# Altium schematic sheet TivaETH.SchDoc
size A4
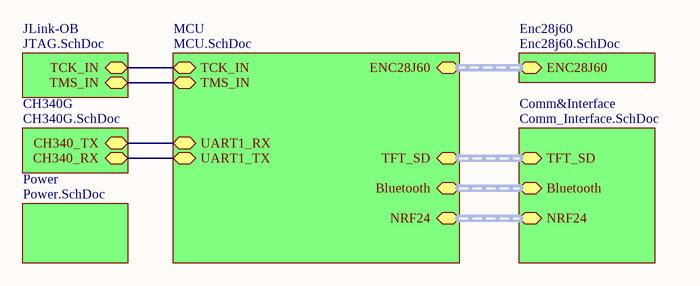
[diagram p0: TivaETH.SchDoc]

## Sub-sheets
CH340G = CH340G.SchDoc: CH340_RX, CH340_TX
Comm&Interface = Comm_Interface.SchDoc: TFT_SD (harness TFT_SD), Bluetooth (harness Bluetooth), NRF24 (harness NRF24)
Enc28j60 = Enc28j60.SchDoc: ENC28J60 (harness Enc28j60)
JLink-OB = JTAG.SchDoc: TCK_IN, TMS_IN
MCU = MCU.SchDoc: TCK_IN, TMS_IN, UART1_RX, UART1_TX, ENC28J60 (harness Enc28j60), Bluetooth (harness Bluetooth), NRF24 (harness NRF24), TFT_SD (harness TFT_SD)
Power = Power.SchDoc: no entries

## Nets
(unnamed): sheet JLink-OB/TCK_IN, sheet MCU/TCK_IN
(unnamed): sheet JLink-OB/TMS_IN, sheet MCU/TMS_IN
(unnamed): sheet MCU/UART1_RX, sheet CH340G/CH340_TX
(unnamed): sheet MCU/UART1_TX, sheet CH340G/CH340_RX

## Buses and harness runs
harness sheet Comm&Interface/Bluetooth = sheet MCU/Bluetooth
harness sheet Comm&Interface/NRF24 = sheet MCU/NRF24
harness sheet Comm&Interface/TFT_SD = sheet MCU/TFT_SD
harness sheet Enc28j60/ENC28J60 = sheet MCU/ENC28J60